# Altium schematic sheet can_transciever_isolated.SchDoc: Dual Isolated CAN transciever
size A4; Organization: UNSW Solar Racing Team; Address3: UNSW; Address4: Sydney NSW 2052; Address2: Electrical Engineering; Address1: Rm 109
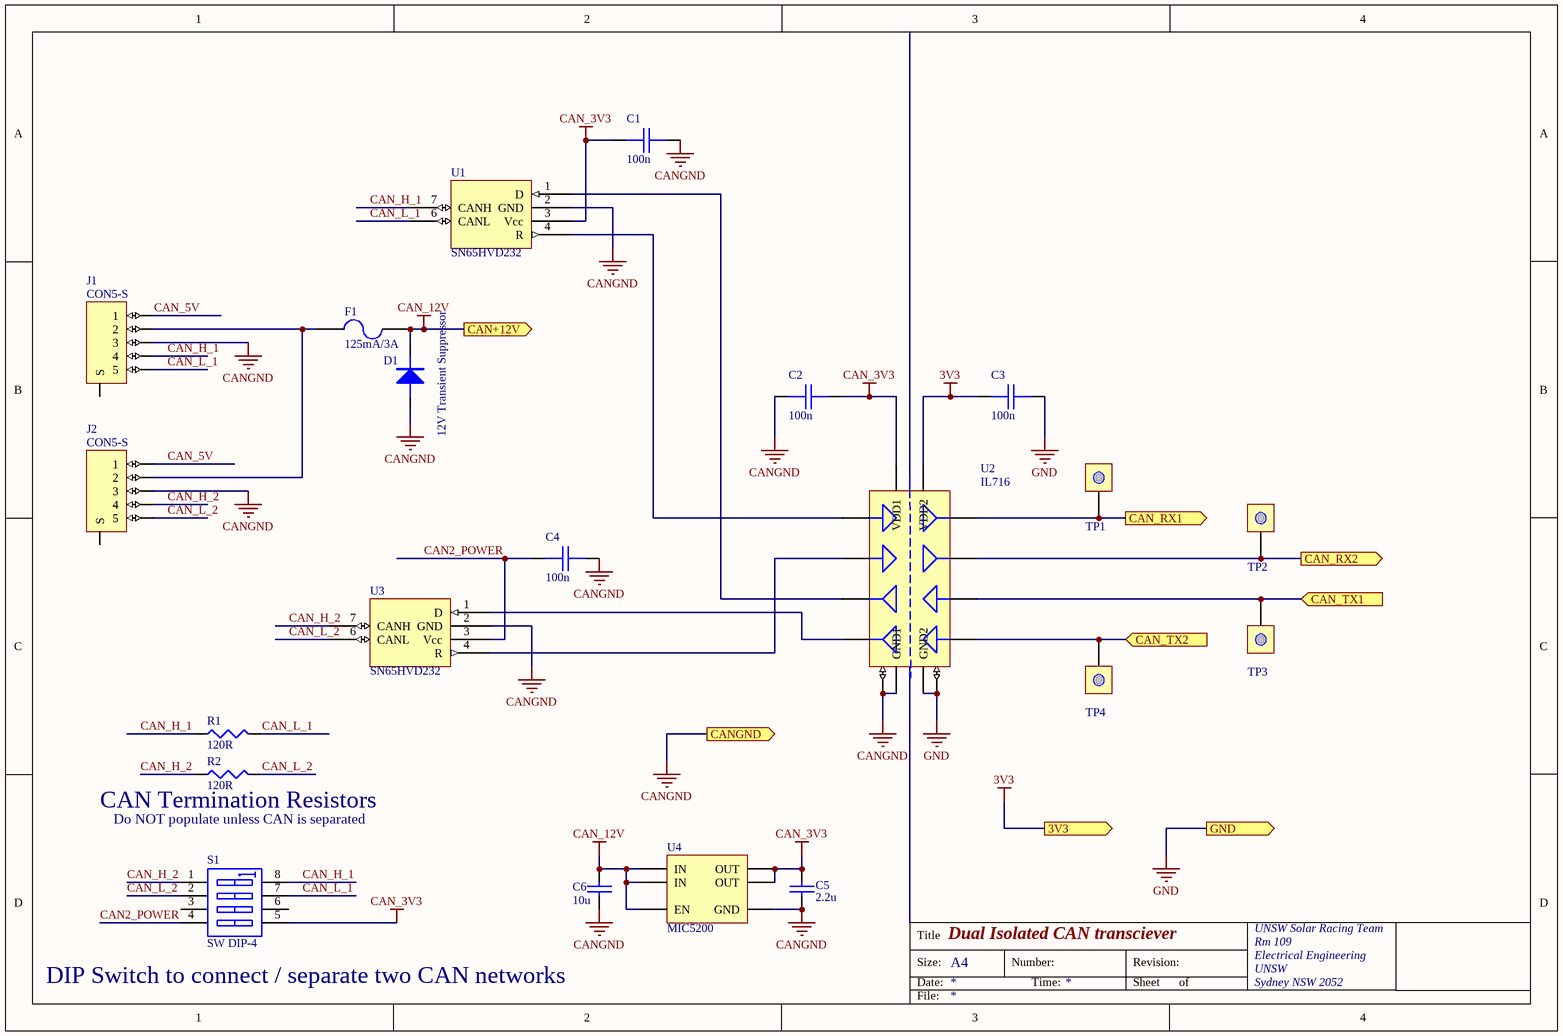
[diagram p0: can_transciever_isolated.SchDoc]

## Parts
C1  100n  [0603]
C2  100n  [0603]
C3  100n  [0603]
C4  100n  [0603]
C5  2.2u  [MCCT-CASEA]
C6  10u  [MCCT-CASEB]
D1  12V Transient Suppressor  [SMA]
F1  125mA/3A  [LITTELFUSE-154]
J1  CON5-S  [TRIAD5F]
J2  CON5-S  [TRIAD5F]
R1  120R  [0603]
R2  120R  [0603]
S1  SW DIP-4  [DIP8]
TP1  TEST  [TESTPOINT]  (value not drawn)
TP2  TEST  [TESTPOINT]  (value not drawn)
TP3  TEST  [TESTPOINT]  (value not drawn)
TP4  TEST  [TESTPOINT]  (value not drawn)
U1  SN65HVD232  [SO8]
U2  IL716  [SO16]
U3  SN65HVD232  [SO8]
U4  MIC5200  [SO8]

## Ports
3V3 (out), CAN+12V (out), CAN_RX1 (out), CAN_RX2 (out), CAN_TX1 (in), CAN_TX2 (in), CANGND (out), GND (out)

## Nets
3V3: C3.2 U2.16(VDD2) ; port 3V3
CAN_3V3: C1.2 C2.2 C5.2 S1.5(B4) U1.3(Vcc) U2.1(VDD1) U4.1(OUT) U4.2(OUT)
CAN_12V: C6.1 D1.K F1.2 U4.5(EN) U4.7(IN) U4.8(IN) ; port CAN+12V
CANGND: C1.1 C2.1 C4.1 C5.1 C6.2 D1.A J1.3 J2.3 U1.2(GND) U2.2(GND1) U2.8(GND1) U3.2(GND) U4.4(GND) ; port CANGND
GND: C3.1 U2.9(GND2) U2.15(GND2) ; port GND
CAN2_POWER: C4.2 S1.4(A4) U3.3(Vcc)
CAN_5V: J1.1 J2.1
CAN_H_1: J1.4 R1.1 S1.8(B1) U1.7(CANH)
CAN_H_2: J2.4 R2.1 S1.1(A1) U3.7(CANH)
CAN_L_1: J1.5 R1.2 S1.7(B2) U1.6(CANL)
CAN_L_2: J2.5 R2.2 S1.2(A2) U3.6(CANL)
CAN_RX1: TP1.0(TP) U2.14(OUT1) ; port CAN_RX1
CAN_RX2: TP2.0(TP) U2.13(OUT2) ; port CAN_RX2
CAN_TX1: TP3.0(TP) U2.12(OUT3) ; port CAN_TX1
CAN_TX2: TP4.0(TP) U2.11(IN4) ; port CAN_TX2
NetF1_1: F1.1 J1.2 J2.2
NetU1_1: U1.1(D) U2.5(IN3)
NetU1_4: U1.4(R) U2.3(IN1)
NetU2_4: U2.4(IN2) U3.4(R)
NetU2_6: U2.6(OUT4) U3.1(D)

Not connected (* = marked no-connect by the designer): J1 0(S); J2 0(S); S1 3(A3) 6(B3)

## Notes on the sheet
- (near R2) CAN Termination Resistors
- Do NOT populate unless CAN is separated
- DIP Switch to connect / separate two CAN networks
- Title
- Size:
- Date:
- A4
- Number:
- Time:
- Revision:
- Sheet
- of
- File:

## Library data of the parts
C1 C4 = CAP: Capacitor; something: 0.31; Note: Purchase a reel.; Farnell: 753-567; Price: 0.30
C2 C3 = CAP: Capacitor; something: 0.31; note: Purchase a reel.; Farnell: 753-567; Price: 0.30
C5 = CAP: Capacitor; Something: 0.938; Farnell: 967-099; Supplier: Farnell.; Price: 0.938
C6 = CAP: Capacitor; Farnell: 967-117; Price: 1.45
D1 = DIODE: Farnell: 9802754; FarnellPrice: 1.20; Digikey: 497-6503-1-ND; DigikeyPrice: 0.56
F1 = FUSE2: Fuse; Farnell: 154-375T (Holder + 125mA fuse) AND 0454 003 (3A Fuse); Price: 4.00
J1 J2 = CON5-S: Connector, 2 pin, with shield @ S; Farnell: 131-040; Price: 16.79
R1 R2 = RES1: Resistor
S1 = SW DIP-4: DIP Switch, 4 Position, SPST; Published: 24-Mar-1999; LatestRevisionDate: 17-Jul-2002; LatestRevisionNote: Re-released for DXP Platform.; PackageReference: SO8; Publisher: Altium Limited; Code_JEDEC: MS-012-AA; Code_IPC: SO8; Farnell: 9901680; FarnellPrice: 5.28
TP1-TP4 = TEST: TEST POINT
U1 U3 = SN65HVD232: 3.3V CAN Transciever; Part Field 2: 5.00; Part Field 3: www.ti.com - Texas Instruments; Farnell: NA
U2 = IL716: 2Tx 2Rx Digital Isolator; Farnell: 9570640; FarnellPrice: 24.61; Digikey: 390-1065-5-ND; DigikeyPrice: 7.70
U4 = MIC5200: MIC5200 - SO8; Part Field 2: 2.00; Part Field 3: Computer Science and Engineering; Part Field 4: David Johnson; Farnell: 572-111; Price: 10.72